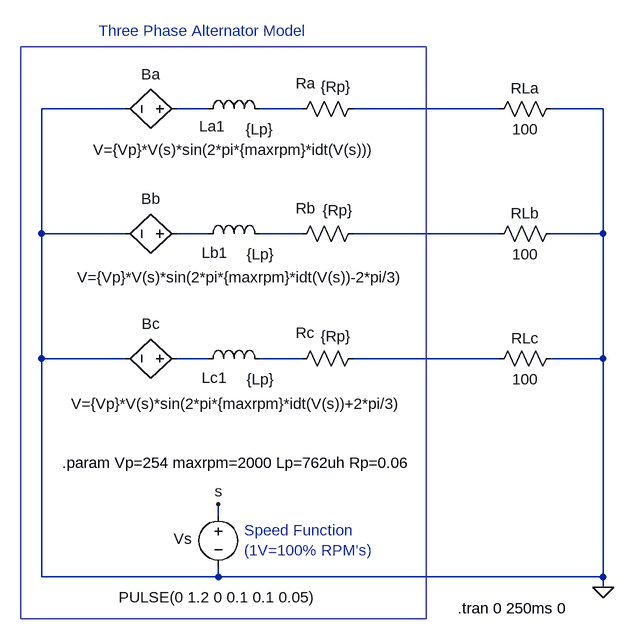
[diagram p0: schematic 3_Phase_Alternator_Model.asc]
3_Phase_Alternator_Model.asc, the LTspice schematic file:
Version 4
SHEET 1 880 680
WIRE 32 -512 -96 -512
WIRE 160 -512 112 -512
WIRE 304 -512 240 -512
WIRE 608 -512 384 -512
WIRE 768 -512 688 -512
WIRE -96 -320 -96 -512
WIRE 32 -320 -96 -320
WIRE 160 -320 112 -320
WIRE 304 -320 240 -320
WIRE 608 -320 384 -320
WIRE 768 -320 768 -512
WIRE 768 -320 688 -320
WIRE -96 -128 -96 -320
WIRE 32 -128 -96 -128
WIRE 160 -128 112 -128
WIRE 304 -128 240 -128
WIRE 608 -128 384 -128
WIRE 768 -128 768 -320
WIRE 768 -128 688 -128
WIRE 176 112 176 96
WIRE -96 208 -96 -128
WIRE 176 208 176 192
WIRE 176 208 -96 208
WIRE 768 208 768 -128
WIRE 768 208 176 208
WIRE 768 224 768 208
FLAG 176 96 s
FLAG 768 224 0
SYMBOL voltage 176 96 R0
WINDOW 0 -69 53 Left 0
WINDOW 3 -153 143 Left 0
WINDOW 123 0 0 Left 0
WINDOW 39 0 0 Left 0
SYMATTR InstName Vs
SYMATTR Value PULSE(0 1.2 0 0.1 0.1 0.05)
SYMBOL bv 128 -512 R90
WINDOW 0 -38 56 VBottom 0
WINDOW 3 47 -73 VTop 0
SYMATTR InstName Ba
SYMATTR Value V={Vp}*V(s)*sin(2*pi*{maxrpm}*idt(V(s)))
SYMBOL bv 128 -320 R90
WINDOW 0 -38 56 VBottom 0
WINDOW 3 51 -83 VTop 0
SYMATTR InstName Bb
SYMATTR Value V={Vp}*V(s)*sin(2*pi*{maxrpm}*idt(V(s))-2*pi/3)
SYMBOL bv 128 -128 R90
WINDOW 0 -38 56 VBottom 0
WINDOW 3 54 -77 VTop 0
SYMATTR InstName Bc
SYMATTR Value V={Vp}*V(s)*sin(2*pi*{maxrpm}*idt(V(s))+2*pi/3)
SYMBOL ind 144 -496 R270
WINDOW 0 -26 23 VTop 0
WINDOW 3 0 96 VBottom 0
SYMATTR InstName La1
SYMATTR Value {Lp}
SYMBOL res 400 -528 R90
WINDOW 0 -8 90 VBottom 0
WINDOW 3 -34 43 VTop 0
SYMATTR InstName Ra
SYMATTR Value {Rp}
SYMBOL ind 144 -304 R270
WINDOW 0 -29 27 VTop 0
WINDOW 3 0 97 VBottom 0
SYMATTR InstName Lb1
SYMATTR Value {Lp}
SYMBOL res 400 -336 R90
WINDOW 0 -8 90 VBottom 0
WINDOW 3 -36 40 VTop 0
SYMATTR InstName Rb
SYMATTR Value {Rp}
SYMBOL ind 144 -112 R270
WINDOW 0 -29 26 VTop 0
WINDOW 3 0 97 VBottom 0
SYMATTR InstName Lc1
SYMATTR Value {Lp}
SYMBOL res 400 -144 R90
WINDOW 0 -8 90 VBottom 0
WINDOW 3 -34 43 VTop 0
SYMATTR InstName Rc
SYMATTR Value {Rp}
SYMBOL res 704 -528 R90
WINDOW 0 0 56 VBottom 0
WINDOW 3 32 56 VTop 0
SYMATTR InstName RLa
SYMATTR Value 100
SYMBOL res 704 -336 R90
WINDOW 0 0 56 VBottom 0
WINDOW 3 32 56 VTop 0
SYMATTR InstName RLb
SYMATTR Value 100
SYMBOL res 704 -144 R90
WINDOW 0 0 56 VBottom 0
WINDOW 3 32 56 VTop 0
SYMATTR InstName RLc
SYMATTR Value 100
TEXT -8 -632 Left 0 ;Three Phase Alternator Model
TEXT 544 256 Left 0 !.tran 0 250ms 0
TEXT -64 32 Left 0 !.param Vp=254 maxrpm=2000 Lp=762uh Rp=0.06
TEXT 216 136 Left 0 ;Speed Function \n(1V=100% RPM's)
RECTANGLE Normal 496 272 -128 -608

The netlist it stands for:
* 3_Phase_Alternator_Model.asc
Vs s 0 PULSE(0 1.2 0 0.1 0.1 0.05)
Ba N001 0 V={Vp}*V(s)*sin(2*pi*{maxrpm}*idt(V(s)))
Bb N004 0 V={Vp}*V(s)*sin(2*pi*{maxrpm}*idt(V(s))-2*pi/3)
Bc N007 0 V={Vp}*V(s)*sin(2*pi*{maxrpm}*idt(V(s))+2*pi/3)
La1 N001 N002 {Lp}
Ra N003 N002 {Rp}
Lb1 N004 N005 {Lp}
Rb N006 N005 {Rp}
Lc1 N007 N008 {Lp}
Rc N009 N008 {Rp}
RLa 0 N003 100
RLb 0 N006 100
RLc 0 N009 100
* Three Phase Alternator Model
.tran 0 250ms 0
.param Vp=254 maxrpm=2000 Lp=762uh Rp=0.06
* Speed Function
* (1V=100% RPM's)
.backanno
.end